# EasyEDA Pro project ProPrj_工训赛物料搬运主控_2025-03-02.epro, board PCB_PCB_主控有光耦2.0_2025-02-19_1
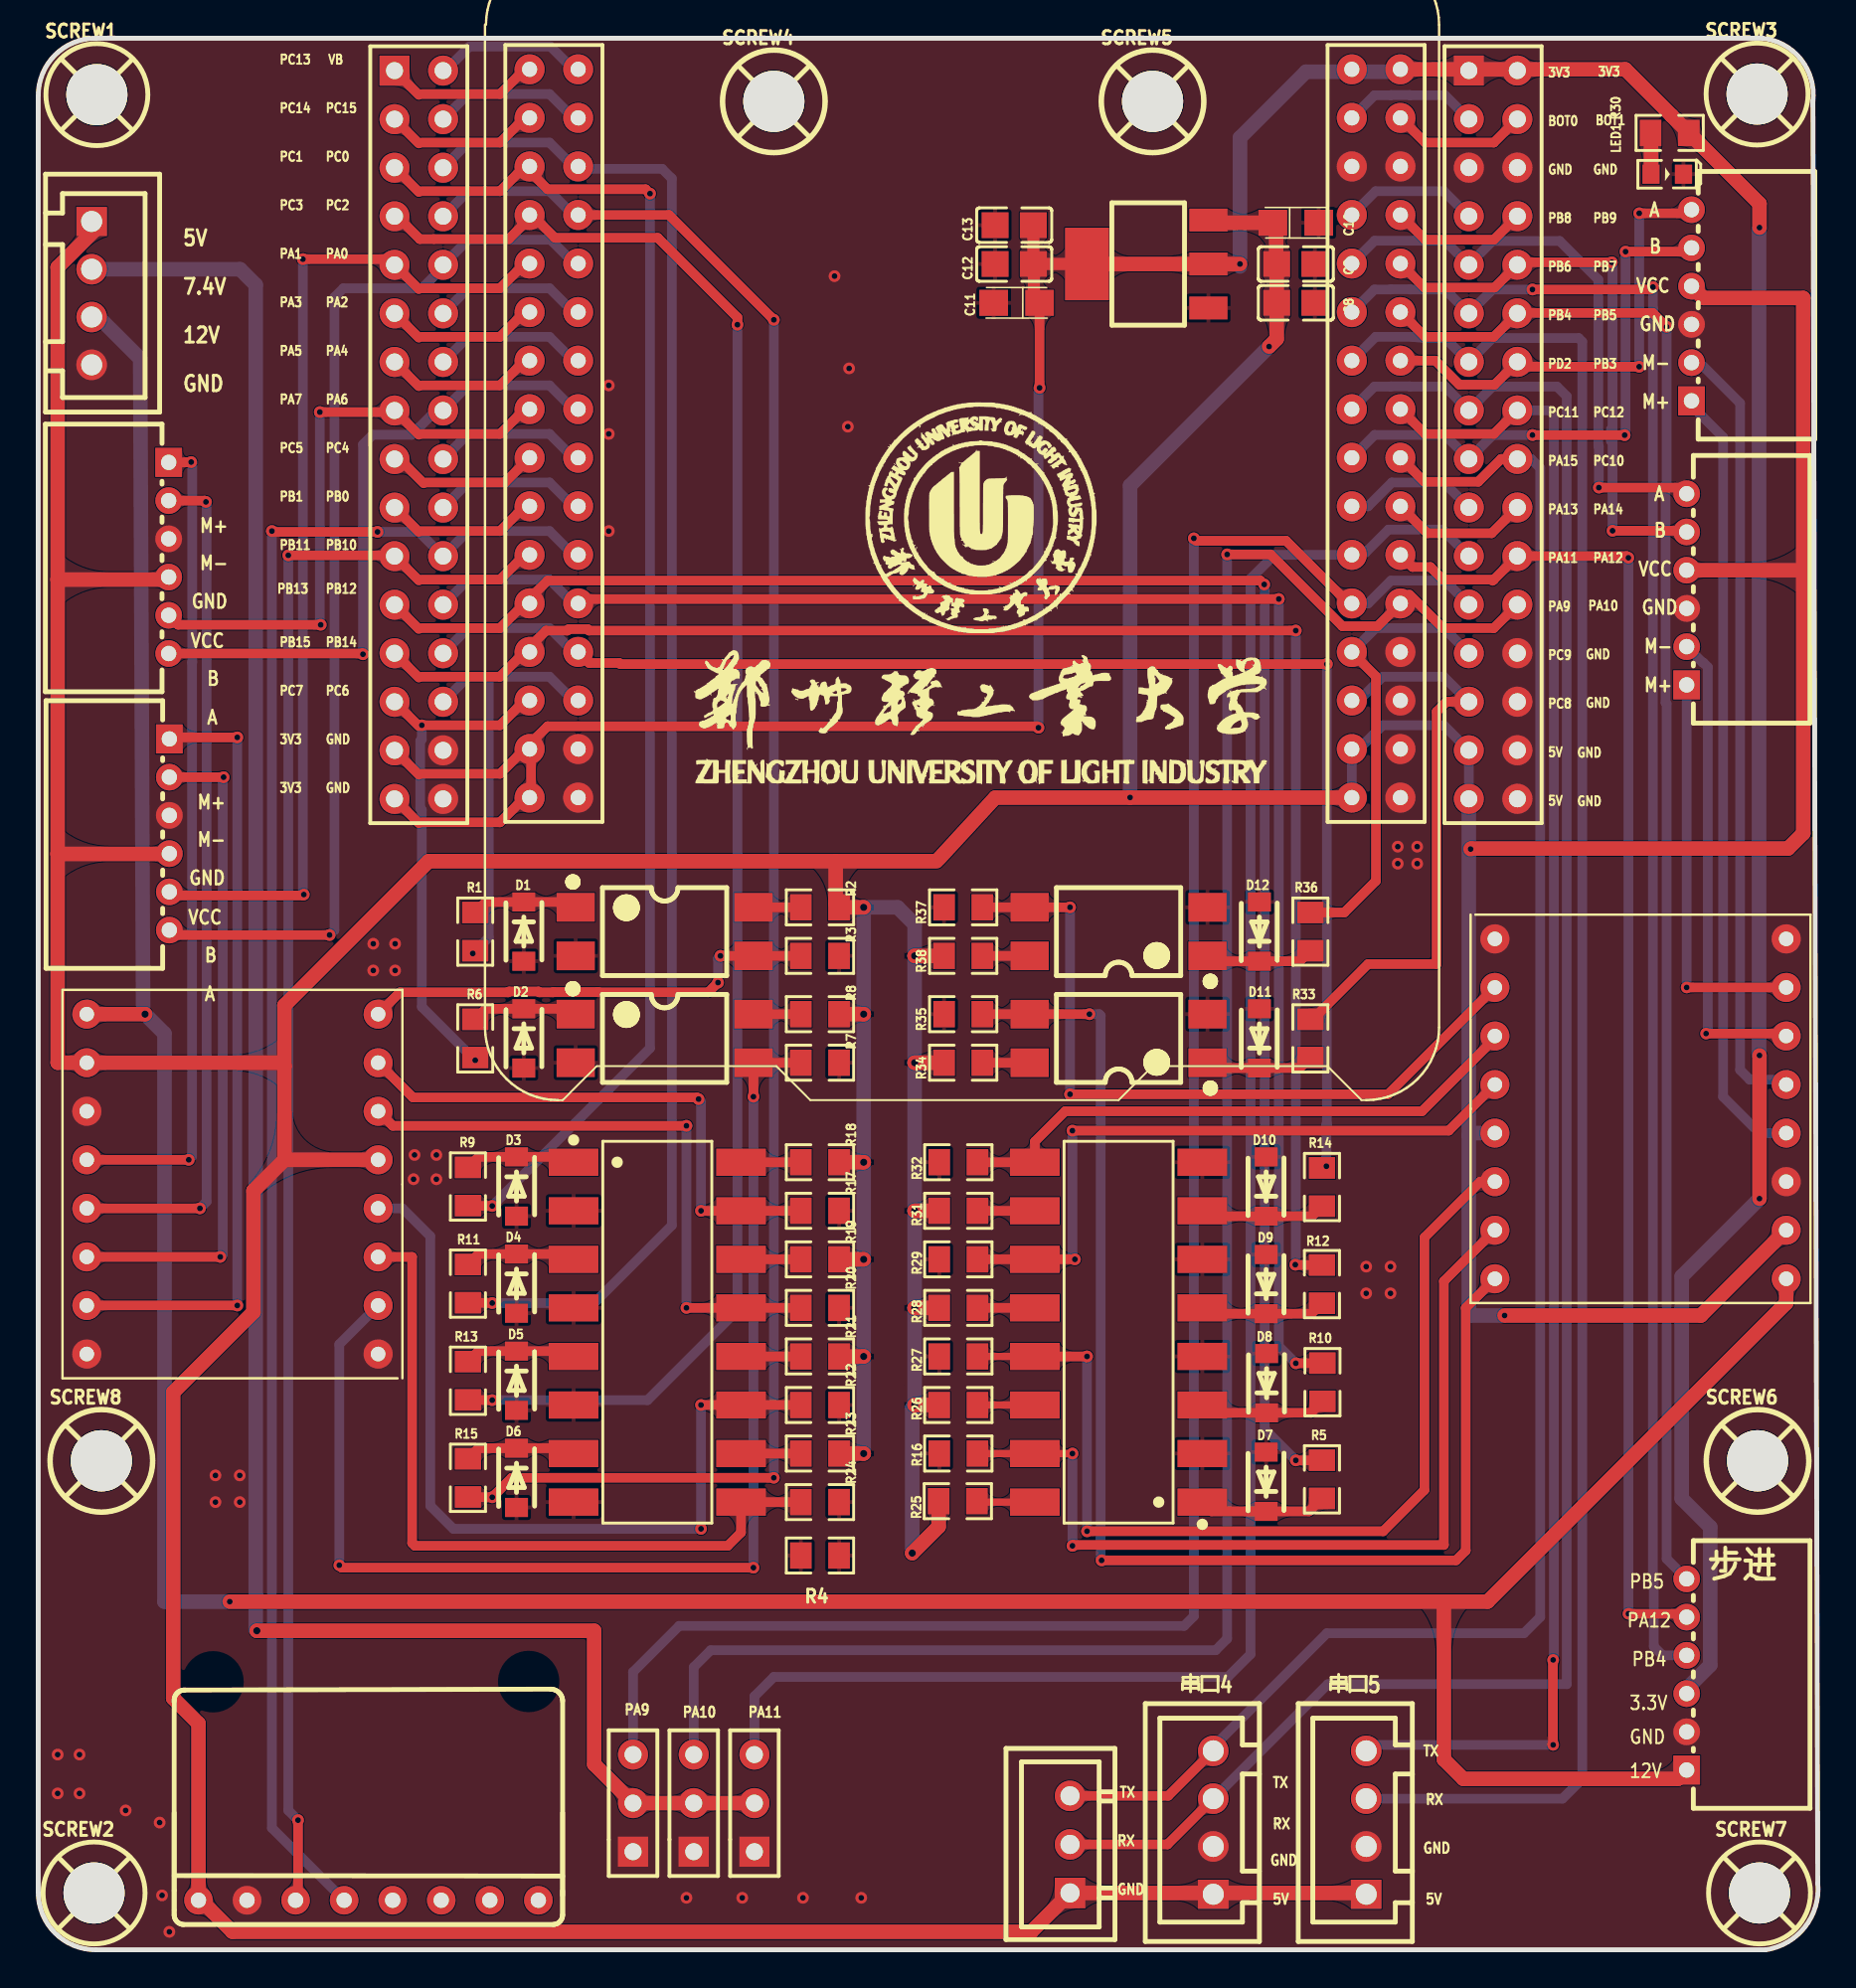
[diagram p5: board, top side]
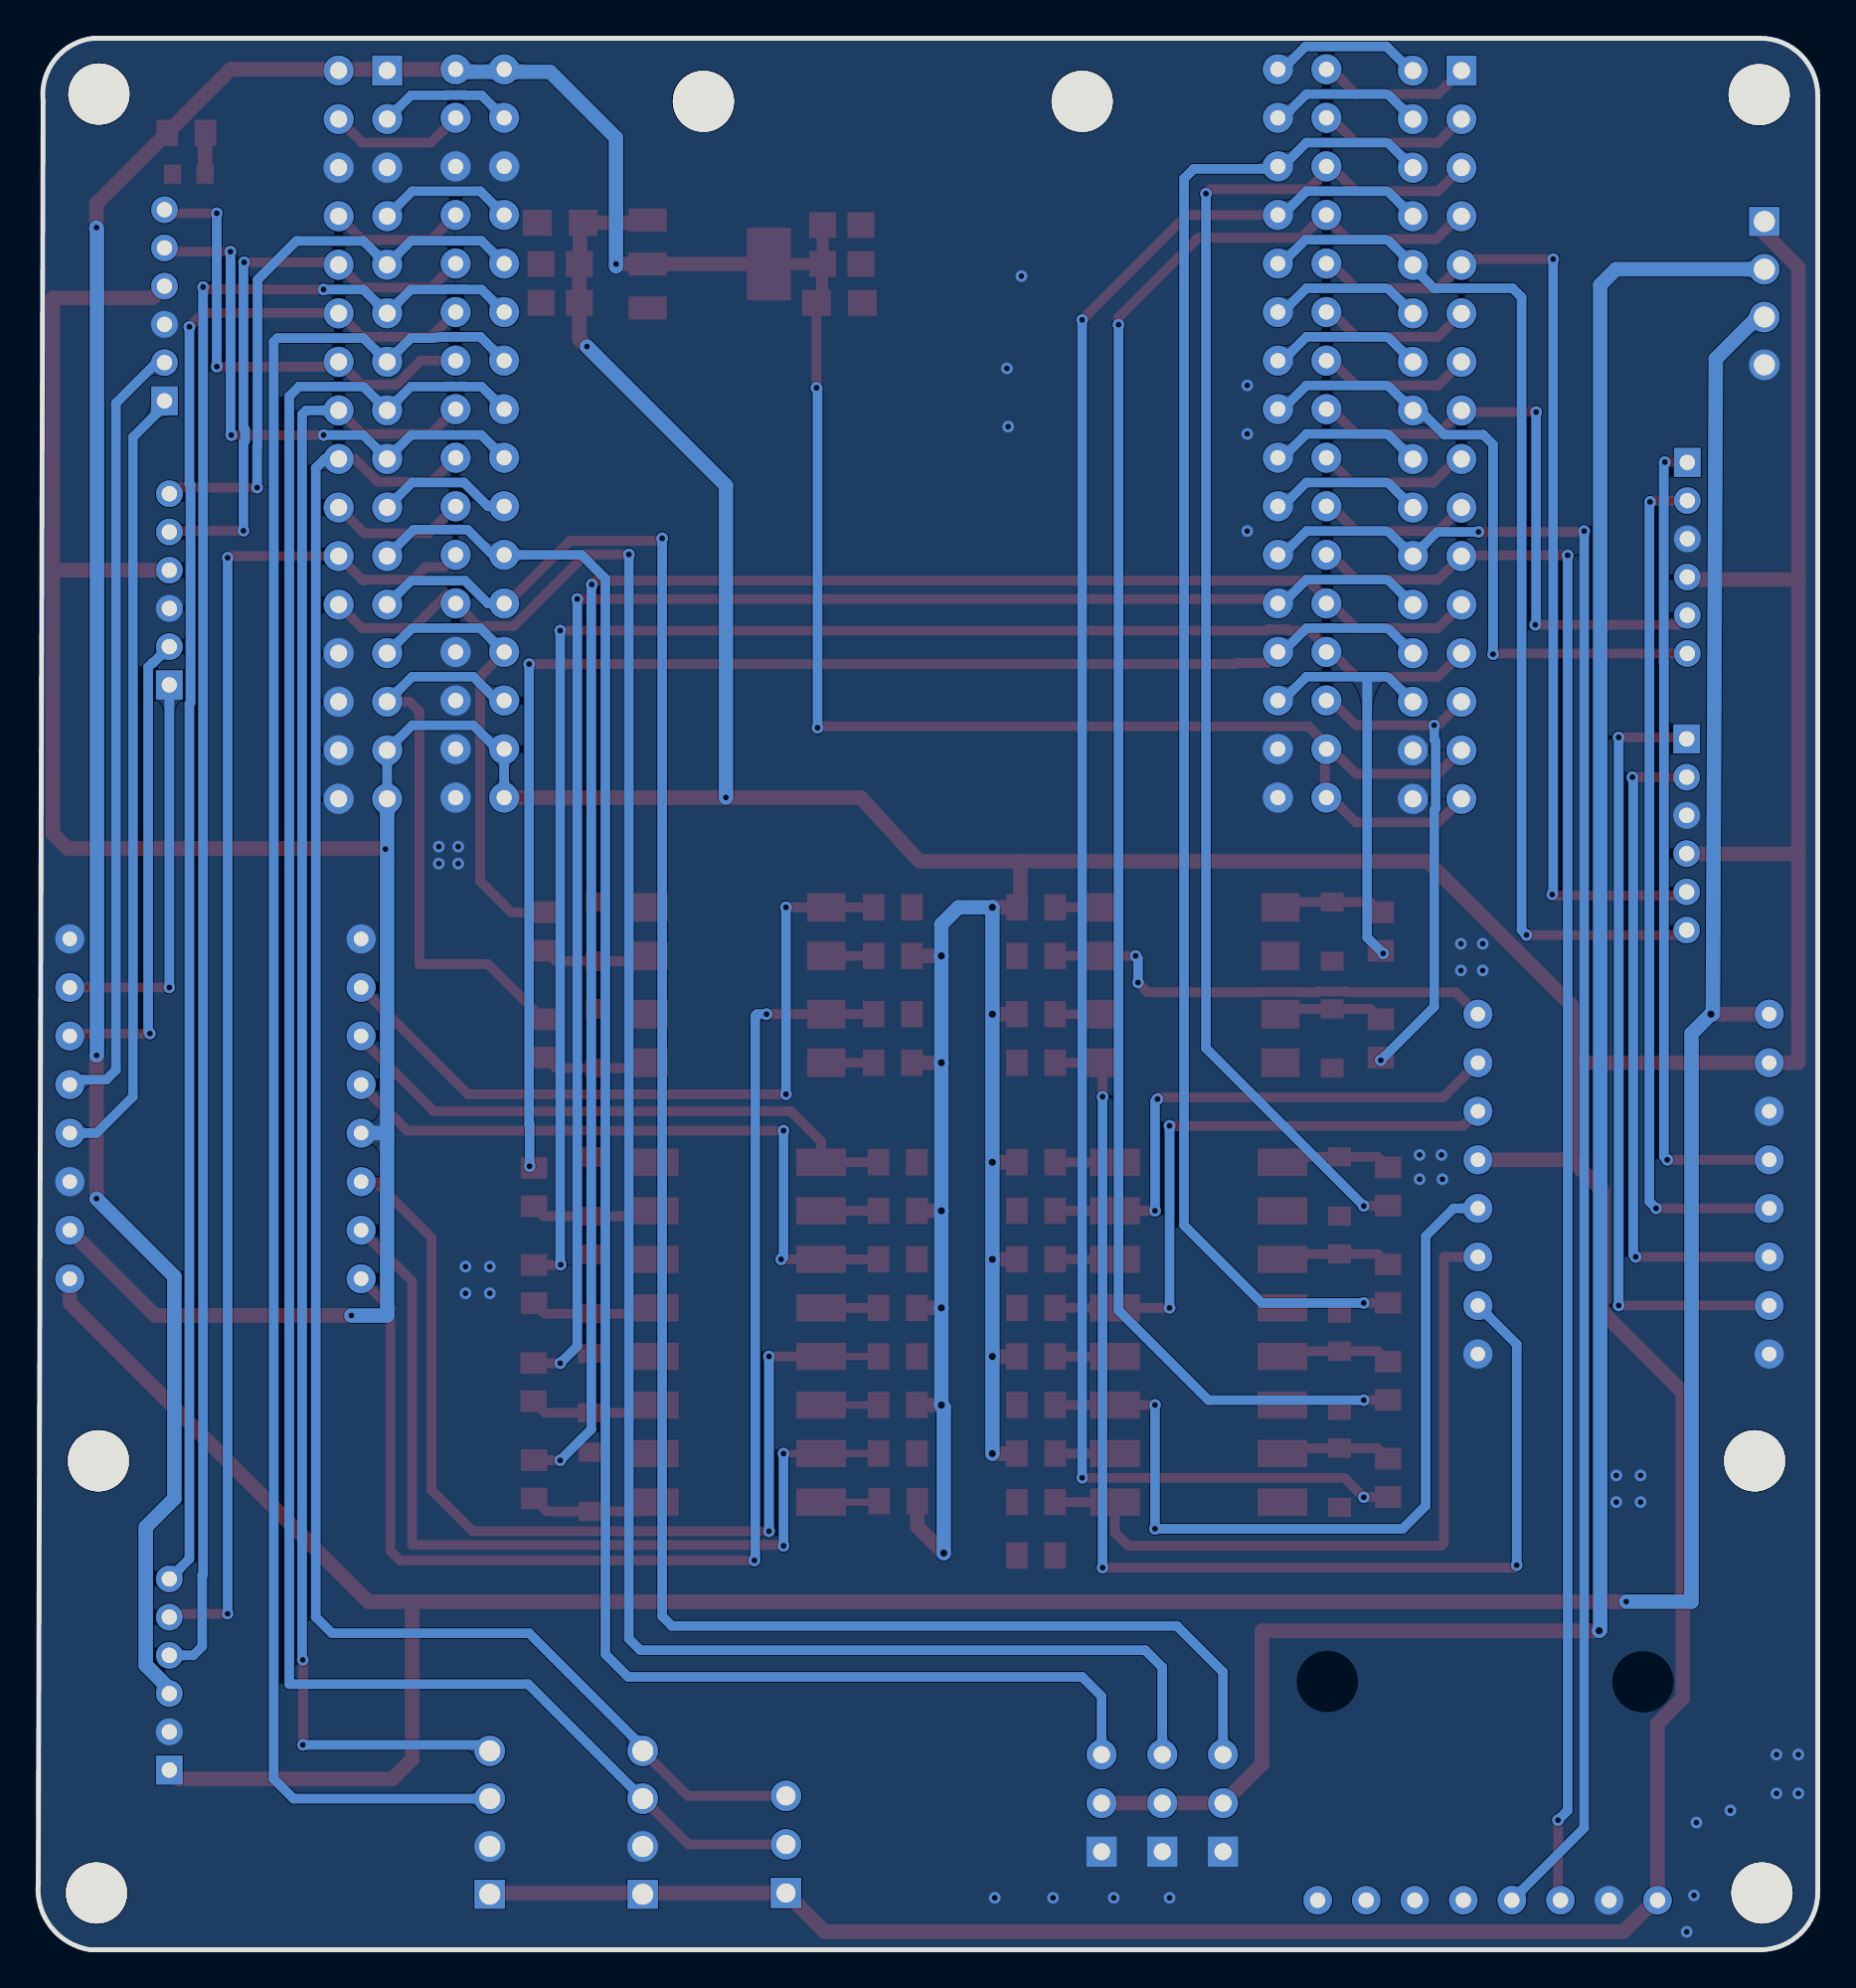
[diagram p6: board, bottom side, seen from below]

Outline 93.09 x 100 mm; copper layers: Top Layer, Bottom Layer. Coordinates in mm from the lower left corner of the outline.
Outline path: 0,97 arc(0.88,99.12) 3,100 90.21,100 arc(92.21,98.9) 92.84,96.7 93.09,3.48 arc(92.43,1.2) 90.38,0 3,0 arc(0.88,0.88) 0,3 0,97
Stack: Top Layer 0.035mm / Dielectric1 1.51mm FR4 er 4.5 / Bottom Layer 0.035mm

## Design rules (mm)
spacing Default (default): track to track 0.152, other pairs 0 to 0.152
track width Default (default): min 0.254, default 0.254, max 25.4
differential pair differentialPair (default): width min 0.127, default 0.254, max 2.54; gap min 0.152, default 0.152
via Default (default): diameter min 0.61, default 0.61, max 100.025; hole min 0.305, default 0.305, max 59.995

## Placement (name value [footprint] x y rotation side)
C8  0.1u  [C0805]  65.79 86.16 180 top
C9  10u  [C0805]  65.79 88.19 180 top
C10  0.1u  [CASE-A_3216]  65.79 90.35 0 top
C11  0.1u  [CASE-A_3216]  51.18 86.16 180 top
C12  10u  [C0805]  51.05 88.19 0 top
C13  0.1u  [C0805]  51.05 90.22 0 top
CN1  KH-PH-6P-W  [CONN-TH_6P-P2.00_KINGHELM_KH-PH-6P-W]  6.82 72.81 270 top
CN2  KH-PH-6P-W  [CONN-TH_6P-P2.00_KINGHELM_KH-PH-6P-W]  6.86 58.34 270 top
CN3  KH-PH-6P-W  [CONN-TH_6P-P2.00_KINGHELM_KH-PH-6P-W]  86.49 86.03 90 top
CN4  KH-PH-6P-W  [CONN-TH_6P-P2.00_KINGHELM_KH-PH-6P-W]  86.23 71.17 90 top
CN7  KH-PH-6P-W  [CONN-TH_6P-P2.00_KINGHELM_KH-PH-6P-W]  86.23 14.4 90 top
CN10  -  [CONN-TH_4P-P2.50_4PIN]  69.47 6.66 90 top
CN10#2  -  [CONN-TH_4P-P2.50_4PIN]  2.79 86.67 270 top
CN11  ZX-XH2.54-4PZZ  [CONN-TH_4P-P2.50_4PIN]  61.47 6.66 90 top
CN12  ZX-XH2.54-3PZZ  [CONN-TH_3P-P2.54_2501S-3P]  53.97 5.51 90 top
D1  1N4001W  [SOD-123F_L2.8-W1.8-LS3.7-RD]  25.4 53.26 270 top
D2  1N4001W  [SOD-123F_L2.8-W1.8-LS3.7-RD]  25.4 47.68 270 top
D3  1N4001W  [SOD-123F_L2.8-W1.8-LS3.7-RD]  25.02 39.93 270 top
D4  1N4001W  [SOD-123F_L2.8-W1.8-LS3.7-RD]  25.02 34.85 270 top
D5  1N4001W  [SOD-123F_L2.8-W1.8-LS3.7-RD]  25.02 29.77 270 top
D6  1N4001W  [SOD-123F_L2.8-W1.8-LS3.7-RD]  25.02 24.69 270 top
D7  1N4001W  [SOD-123F_L2.8-W1.8-LS3.7-RD]  64.23 24.48 90 top
D8  1N4001W  [SOD-123F_L2.8-W1.8-LS3.7-RD]  64.26 29.64 90 top
D9  1N4001W  [SOD-123F_L2.8-W1.8-LS3.7-RD]  64.23 34.82 90 top
D10  1N4001W  [SOD-123F_L2.8-W1.8-LS3.7-RD]  64.23 39.93 90 top
D11  1N4001W  [SOD-123F_L2.8-W1.8-LS3.7-RD]  63.88 47.68 90 top
D12  1N4001W  [SOD-123F_L2.8-W1.8-LS3.7-RD]  63.88 53.26 90 top
H1  HDR-F-2.54_2x16  [HDR-F-2.54_2X16]  19.91 79.26 270 top
H2  HDR-F-2.54_2x16  [HDR-F-2.54_2X16]  76.11 79.26 270 top
J2  HDR-M-2.54_1x3  [HDR-M-2.54_1X3]  31.12 7.67 90 top
J3  HDR-M-2.54_1x3  [HDR-M-2.54_1X3]  34.29 7.67 90 top
J4  HDR-M-2.54_1x3  [HDR-M-2.54_1X3]  37.47 7.67 90 top
LED1  LED-0603_R  [LED0603_RED]  85.22 92.89 0 top
P1  -  [MPU6050模块]  17.53 5.89 270 top
R1  215Ω  [R0805]  22.86 53.26 90 top
R2  2k  [R0805]  40.89 54.53 0 top
R3  10k  [R0805]  40.89 51.99 0 top
R4  0  [R0805]  40.89 20.62 0 top
R5  215Ω  [R0805]  67.16 24.61 270 top
R6  215Ω  [R0805]  22.86 47.68 90 top
R7  10k  [R0805]  40.89 46.41 0 top
R8  2k  [R0805]  40.89 48.95 0 top
R9  215Ω  [R0805]  22.48 39.93 90 top
R10  215Ω  [R0805]  67.18 29.69 270 top
R11  215Ω  [R0805]  22.48 34.85 90 top
R12  215Ω  [R0805]  67.16 34.82 270 top
R13  215Ω  [R0805]  22.48 29.77 90 top
R14  215Ω  [R0805]  67.16 39.9 270 top
R15  215Ω  [R0805]  22.48 24.69 90 top
R16  10k  [R0805]  48.13 25.96 180 top
R17  10k  [R0805]  40.89 38.66 0 top
R18  2k  [R0805]  40.89 41.2 0 top
R19  2k  [R0805]  40.89 36.12 0 top
R20  10k  [R0805]  40.89 33.58 0 top
R21  2k  [R0805]  40.89 31.04 0 top
R22  10k  [R0805]  40.89 28.5 0 top
R23  2k  [R0805]  40.89 25.96 0 top
R24  10k  [R0805]  40.89 23.42 0 top
R25  2k  [R0805]  48.1 23.47 180 top
R26  2k  [R0805]  48.13 28.5 180 top
R27  10k  [R0805]  48.13 31.04 180 top
R28  2k  [R0805]  48.13 33.58 180 top
R29  10k  [R0805]  48.13 36.12 180 top
R30  1k  [R0805]  85.34 95.05 0 top
R31  2k  [R0805]  48.13 38.66 180 top
R32  10k  [R0805]  48.13 41.2 180 top
R33  215Ω  [R0805]  66.55 47.68 270 top
R34  2k  [R0805]  48.39 46.41 180 top
R35  10k  [R0805]  48.39 48.95 180 top
R36  215Ω  [R0805]  66.55 53.26 270 top
R37  10k  [R0805]  48.39 54.53 180 top
R38  2k  [R0805]  48.39 51.99 180 top
SCREW1  -  [M3螺丝]  3.07 97.05 0 top
SCREW2  -  [M3螺丝]  2.92 2.97 0 top
SCREW3  -  [M3螺丝]  89.92 97.08 0 top
SCREW4  -  [M3螺丝]  38.48 96.7 0 top
SCREW5  -  [M3螺丝]  58.29 96.7 0 top
SCREW6  -  [M3螺丝]  89.94 25.58 0 top
SCREW7  -  [M3螺丝]  90.04 2.97 0 top
SCREW8  -  [M3螺丝]  3.3 25.58 0 top
U1  NO  [STM32F103RCT6最小系统]  48.77 79.43 0 top
U2  -  [TB6612电机驱动]  10.16 40.06 0 top
U3  -  [TB6612电机驱动]  83.82 43.99 180 top
U4  AMS1117-3.3  [SOT-223]  58.04 88.19 180 top
U5  TLP521-1XSM  [SMD-4_L4.6-W6.5-P2.54-LS10.2-BL]  32.77 47.68 270 top
U7  TLP521-1XSM  [SMD-4_L4.6-W6.5-P2.54-LS10.2-BL]  32.77 53.26 270 top
U8  TLP521-4XSM  [SMD-16_L20.0-W6.5-P2.54-LS10.2-BL]  32.38 32.31 270 top
U9  TLP521-4XSM  [SMD-16_L20.0-W6.5-P2.54-LS10.2-BL]  56.51 32.31 90 top
U10  TLP521-1XSM  [SMD-4_L4.6-W6.5-P2.54-LS10.2-BL]  56.51 47.68 90 top
U11  TLP521-1XSM  [SMD-4_L4.6-W6.5-P2.54-LS10.2-BL]  56.51 53.26 90 top

## Footprints (pads in the part's own frame, mm; a bottom-side part is the same pattern mirrored in y, then rotated)
C0805
  rect 1.41x1.35 smd: 1(-1,0) 2(1,0)
CASE-A_3216
  rect 1.5x1.359 smd: 1(-1.2,0) 2(1.2,0)
CONN-TH_3P-P2.54_2501S-3P
  rect 1.6x1.6 hole 1: 1(-2.54,0)
  round 1.6 hole 1: 2(0,0) 3(2.54,0)
CONN-TH_4P-P2.50_4PIN
  rect 1.524x1.6 hole 1.1: 1(-3.75,0)
  round 1.6 hole 1.1: 2(-1.25,0) 3(1.25,0) 4(3.75,0)
CONN-TH_6P-P2.00_KINGHELM_KH-PH-6P-W
  rect 1.524x1.4 hole 0.8: 1(-5,0)
  round 1.4 hole 0.8: 2(-3,0) 3(-1,0) 4(1,0) 5(3,0) 6(5,0)
HDR-F-2.54_2X16
  rect 1.575x1.575 hole 0.889: 1(-19.05,-1.27)
  round 1.575 hole 0.889: 2(-19.05,1.27) 3(-16.51,-1.27) 4(-16.51,1.27) 5(-13.97,-1.27) 6(-13.97,1.27) 7(-11.43,-1.27) 8(-11.43,1.27) 9(-8.89,-1.27) 10(-8.89,1.27) 11(-6.35,-1.27) 12(-6.35,1.27) 13(-3.81,-1.27) 14(-3.81,1.27) 15(-1.27,-1.27) 16(-1.27,1.27) 17(1.27,-1.27) 18(1.27,1.27) 19(3.81,-1.27) 20(3.81,1.27) 21(6.35,-1.27) 22(6.35,1.27) 23(8.89,-1.27) 24(8.89,1.27) 25(11.43,-1.27) 26(11.43,1.27) 27(13.97,-1.27) 28(13.97,1.27) 29(16.51,-1.27) 30(16.51,1.27) 31(19.05,-1.27) 32(19.05,1.27)
HDR-M-2.54_1X3
  rect 1.575x1.575 hole 0.889: 1(-2.54,0)
  round 1.575 hole 0.889: 2(0,0) 3(2.54,0)
LED0603_RED
  rect 0.9x1 smd: 1(-0.85,0) 2(0.85,0)
M3螺丝
  round 3.2 hole 3.2: 1(0,0)
MPU6050模块
  round 1.5 hole 0.8: 1(3.302,-9.144) 2(3.302,-6.604) 3(3.302,-4.064) 4(3.302,-1.524) 5(3.302,1.016) 6(3.302,3.556) 7(3.302,6.096) 8(3.302,8.636)
R0805
  rect 1.133x1.377 smd: 1(-1,0) 2(1,0)
SMD-4_L4.6-W6.5-P2.54-LS10.2-BL
  rect 1.5x2 smd: 1(-1.27,-4.65) 2(1.27,-4.65) 3(1.27,4.65) 4(-1.27,4.65)
SMD-16_L20.0-W6.5-P2.54-LS10.2-BL
  rect 1.423x2.6 smd: 1(-8.89,-4.38) 2(-6.35,-4.38) 3(-3.81,-4.38) 4(-1.27,-4.38) 5(1.27,-4.38) 6(3.81,-4.38) 7(6.35,-4.38) 8(8.89,-4.38) 9(8.89,4.38) 10(6.35,4.38) 11(3.81,4.38) 12(1.27,4.38) 13(-1.27,4.38) 14(-3.81,4.38) 15(-6.35,4.38) 16(-8.89,4.38)
SOD-123F_L2.8-W1.8-LS3.7-RD
  rect 1x1.2 smd: 1(-1.55,0) 2(1.55,0)
SOT-223
  rect 2x1.2 smd: 1(-3.175,2.3) 2(-3.175,0) 3(-3.175,-2.3)
  rect 2.3x3.8 smd: 4(3.175,0)
STM32F103RCT6最小系统
  round 1.575 hole 0.787x0.792: 3V3_1(-23.063,-16.611) 3V3_2(-23.063,-19.151) 3V3_3(19.948,18.948) 3V3_4(22.488,18.948) 5V_1(19.948,-16.613) 5V_2(19.948,-19.152) BOOT0(19.948,16.407) BOOT1(22.488,16.407) GND_1(-20.523,-16.611) GND_2(-20.523,-19.151) GND_3(19.948,13.867) GND_4(22.488,13.867) GND_5(22.488,-11.533) GND_6(22.488,-14.072) GND_7(22.488,-16.613) GND_8(22.488,-19.152) PA0(-20.523,8.789) PA1(-23.063,8.789) PA2(-20.523,6.248) PA3(-23.063,6.248) PA4(-20.523,3.708) PA5(-23.063,3.708) PA6(-20.523,1.169) PA7(-23.063,1.169) PA9(19.948,-8.992) PA10(22.488,-8.992) PA11(19.948,-6.452) PA12(22.488,-6.452) PA13(19.948,-3.913) PA14(22.488,-3.913) PA15(19.948,-1.373) PB0(-20.523,-3.912) PB1(-23.063,-3.912) PB3(22.488,3.708) PB4(19.948,6.247) PB5(22.488,6.247) PB6(19.948,8.787) PB7(22.488,8.787) PB8(19.948,11.328) PB9(22.488,11.328) PB10(-20.523,-6.452) PB11(-23.063,-6.452) PB12(-20.523,-8.992) PB13(-23.063,-8.992) PB14(-20.523,-11.531) PB15(-23.063,-11.531) PC0(-20.523,13.868) PC1(-23.063,13.868) PC2(-20.523,11.329) PC3(-23.063,11.329) PC4(-20.523,-1.371) PC5(-23.063,-1.371) PC6(-20.523,-14.072) PC7(-23.063,-14.072) PC8(19.948,-14.072) PC9(19.948,-11.533) PC10(22.488,-1.373) PC11(19.948,1.167) PC12(22.488,1.167) PC13(-23.063,18.948) PC14(-23.063,16.409) PC15(-20.523,16.409) PD2(19.948,3.708) VB(-20.523,18.948)
TB6612电机驱动
  round 1.524 hole 0.762: 1(7.62,8.89) 2(7.62,6.35) 3(7.62,3.81) 4(7.62,1.27) 5(7.62,-1.27) 6(7.62,-3.81) 7(7.62,-6.35) 8(7.62,-8.89) 9(-7.62,-8.89) 10(-7.62,-6.35) 11(-7.62,-3.81) 12(-7.62,-1.27) 13(-7.62,1.27) 14(-7.62,3.81) 15(-7.62,6.35) 16(-7.62,8.89)

## Nets
3.3V: C11.1 C12.2 C13.2 CN7.3 H1.29 H1.31 H2.1 H2.2 R30.2 U1.3V3_1 U1.3V3_2 U1.3V3_3 U1.3V3_4 U4.2 U4.4
5V: C8.2 C9.2 C10.1 CN1.4 CN2.4 CN3.4 CN4.4 CN10.1 CN10#2.1 CN11.1 CN12.1 H2.29 H2.31 P1.1 R2.2 R8.2 R18.2 R19.2 R21.2 R23.2 R25.2 R26.2 R28.2 R31.2 R34.2 R38.2 U1.5V_1 U1.5V_2 U2.4 U2.15 U3.4 U3.15 U4.3
7.4V: CN10#2.2 J2.2 J3.2 J4.2
12V: CN7.1 CN10#2.3 U2.16 U3.16
GND: C8.1 C9.1 C10.2 C11.2 C12.1 C13.1 CN1.3 CN2.3 CN3.3 CN4.3 CN7.2 CN10.2 CN10#2.4 CN11.2 D1.2 D2.2 D3.2 D4.2 D5.2 D6.2 D7.2 D8.2 D9.2 D10.2 D11.2 D12.2 H1.30 H1.32 H2.5 H2.6 H2.26 H2.28 H2.30 H2.32 J2.1 J3.1 J4.1 LED1.2 P1.2 R4.1 U1.GND_1 U1.GND_2 U1.GND_3 U1.GND_4 U1.GND_5 U1.GND_6 U1.GND_7 U1.GND_8 U2.8 U2.9 U2.14 U3.8 U3.9 U3.14 U4.1 U5.2 U7.2 U8.2 U8.4 U8.6 U8.8 U9.2 U9.4 U9.6 U9.8 U10.2 U11.2
BOOT0: H2.3 U1.BOOT0
BOOT1: H2.4 U1.BOOT1
D1_1: D1.1 R1.2 U7.1
D3_1: D3.1 R9.2 U8.1
D4_1: D4.1 R11.2 U8.3
D5_1: D5.1 R13.2 U8.5
D6_1: D6.1 R15.2 U8.7
GGND: R3.2 R4.2 R7.2 R16.2 R17.2 R20.2 R22.2 R24.2 R27.2 R29.2 R32.2 R35.2 R37.2
LA1: CN1.6 H1.16 U1.PA6
LA2: CN2.6 H1.10 U1.PA0
LAIN1: H1.6 R11.1 U1.PC0
LAIN2: H1.5 R9.1 U1.PC1
LAO1: CN1.1 U2.13
LAO2: CN1.2 U2.12
LB1: CN1.5 H1.15 U1.PA7
LB2: CN2.5 H1.9 U1.PA1
LBIN1: H1.7 R13.1 U1.PC3
LBIN2: H1.8 R15.1 U1.PC2
LBO1: CN2.1 U2.10
LBO2: CN2.2 U2.11
LED17_1: LED1.1 R30.1
LINA1: R20.1 U2.3 U8.13
LINA2: R17.1 U2.2 U8.15
LINB1: R22.1 U2.5 U8.11
LINB2: R24.1 U2.6 U8.9
LPA: R3.1 U2.1 U7.3
LPB: R7.1 U2.7 U5.3
LPWMA: H1.28 R1.1 U1.PC6
LPWMB: H1.27 R6.1 U1.PC7
PA2: H1.12 U1.PA2
PA3: H1.11 U1.PA3
PA4: H1.14 U1.PA4
PA5: H1.13 U1.PA5
PA9: H2.23 J2.3 U1.PA9
PA10: H2.24 J3.3 U1.PA10
PA11: H2.21 J4.3 U1.PA11
PA12: CN7.5 H2.22 U1.PA12
PB0: H1.20 U1.PB0
PB1: H1.19 U1.PB1
PB4: CN7.4 H2.11 U1.PB4
PB5: CN7.6 H2.12 U1.PB5
PB8: H2.7 U1.PB8
PB9: H2.8 U1.PB9
PC4: H1.18 U1.PC4
PC5: H1.17 U1.PC5
PC10: CN11.4 CN12.3 H2.18 U1.PC10
PC11: CN11.3 CN12.2 H2.15 U1.PC11
PC12: CN10.4 H2.16 U1.PC12
PC13: H1.1 U1.PC13
PC14: H1.3 U1.PC14
PC15: H1.4 U1.PC15
PD2: CN10.3 H2.13 U1.PD2
R2_1: R2.1 U7.4
R6_2: D2.1 R6.2 U5.1
R8_1: R8.1 U5.4
R18_1: R18.1 U8.16
R19_1: R19.1 U8.14
R21_1: R21.1 U8.12
R23_1: R23.1 U8.10
RA1: CN3.6 H2.14 U1.PB3
RA2: CN4.6 H2.9 U1.PB6
RAIN1: H1.24 R10.1 U1.PB12
RAIN2: H1.23 R5.1 U1.PB13
RAO1: CN3.1 U3.13
RAO2: CN3.2 U3.12
RB1: CN3.5 H2.17 U1.PA15
RB2: CN4.5 H2.10 U1.PB7
RBIN1: H1.25 R12.1 U1.PB15
RBIN2: H1.26 R14.1 U1.PB14
RBO1: CN4.1 U3.10
RBO2: CN4.2 U3.11
RINA1: R27.1 U3.3 U9.13
RINA2: R16.1 U3.2 U9.15
RINB1: R29.1 U3.5 U9.11
RINB2: R32.1 U3.6 U9.9
RPA: R35.1 U3.1 U10.3
RPB: R37.1 U3.7 U11.3
RPWMA: H2.27 R33.1 U1.PC8
RPWMB: H2.25 R36.1 U1.PC9
SCL: H1.21 P1.3 U1.PB11
SDA: H1.22 P1.4 U1.PB10
SWCLK: H2.20 U1.PA14
SWDIO: H2.19 U1.PA13
U9_1: D7.1 R5.2 U9.1
U9_3: D8.1 R10.2 U9.3
U9_5: D9.1 R12.2 U9.5
U9_7: D10.1 R14.2 U9.7
U9_10: R31.1 U9.10
U9_12: R28.1 U9.12
U9_14: R26.1 U9.14
U9_16: R25.1 U9.16
U10_1: D11.1 R33.2 U10.1
U10_4: R34.1 U10.4
U11_1: D12.1 R36.2 U11.1
U11_4: R38.1 U11.4
VB: H1.2 U1.VB

Pads without a net: P1 5 6 7 8; SCREW1 1; SCREW2 1; SCREW3 1; SCREW4 1; SCREW5 1; SCREW6 1; SCREW7 1; SCREW8 1

## Via types
v1: diameter 0.762, hole 0.381, Top Layer to Bottom Layer, 14 vias
v2: diameter 0.61, hole 0.305, Top Layer to Bottom Layer, 56 vias
v3: diameter 0.62, hole 0.31, Top Layer to Bottom Layer, 70 vias

## Routing (per net, layer and track width the routed paths; a pad name or vN(x,y) marks a point on that pad's centre or on a via; arc(x,y) is an arc through that point)
3.3V: length 202.4
  Top Layer w0.508: 19.91,58.94 H1.31 ; 25.45,62.81 24.16,61.52 20.07,61.52 ; 25.45,62.81 25.78,62.48 25.78,60.6 24.16,58.98 20.07,58.98 ; 25.45,62.81 26.64,64.01 52.25,64.01 v3(52.32,63.93) ; C11.1 v3(52.38,81.71) ; H1.29 19.91,61.48
  Top Layer w0.635: 52.09,88.19 U4.4 ; 52.09,88.19 52.06,88.22 52.06,90.22 ; 52.09,88.19 52.09,86.45 C11.1
  Top Layer w0.762: H2.2 77.44,98.37 ; 77.44,98.37 U1.3V3_4 ; 77.44,98.37 83.03,98.37 85.44,95.96 85.44,95.95 R30.2 90.04,91.35 v2(90.04,90.09) ; v3(62.87,88.19) U4.2 U4.4 ; v2(90.04,46.79) v2(90.04,39.29)
  Bottom Layer w0.508: v3(52.38,81.71) 52.32,81.66 v3(52.32,63.93)
  Bottom Layer w0.762: v2(90.04,90.09) 90.04,90.02 90.02,89.99 90.02,46.81 v2(90.04,46.79) ; 71.64,98.37 71.51,98.25 66.32,98.25 62.87,94.79 62.87,88.06 ; CN7.3 86.23,13.66 87.47,14.89 87.47,22.11 85.97,23.61 85.97,35.22 v2(90.04,39.29)
5V: length 484.9
  Top Layer w0.762: R31.2 v1(45.85,38.66) ; R26.2 v1(45.85,28.5) ; 92.33,72.19 92.31,72.17 CN4.4 ; 92.33,72.19 92.33,86.41 87.11,86.41 CN3.4 ; 92.33,72.19 92.33,58.4 91.54,57.61 74.96,57.61 v2(74.93,57.58) ; 41.71,56.95 41.71,54.71 R2.2 v1(43.18,54.53) ; 41.71,56.95 46.99,56.95 ; 41.71,56.95 20.42,56.95 12.88,49.41 12.88,46.23 ; 1.02,71.68 6.77,71.68 6.82,71.73 ; 1.02,71.68 1.02,57.33 ; 1.02,71.68 1.02,88.02 3.1,90.11 CN10#2.1 ; 8.51,2.59 10.16,0.94 51.94,0.94 CN12.1 61.4,2.97 CN11.1 61.53,2.97 69.54,2.97 CN10.1 ; 1.02,57.33 6.84,57.33 CN2.4 ; 1.02,57.33 1.02,46.41 U2.15 12.7,46.41 12.88,46.23 ; 41.9,36.12 v1(43.18,36.12) ; v2(76.71,33.18) 86.98,33.18 U3.15 ; 12.88,41.33 11.26,39.7 11.26,33.36 7.06,29.16 7.06,13.16 8.38,11.84 P1.1 ; 12.88,41.33 12.88,46.23 ; 12.88,41.33 U2.4 ; C8.2 64.79,84.27 v2(64.39,83.87) ; 57.11,60.27 v2(57.12,60.28) ; 57.11,60.27 50.06,60.27 47.12,57.07 ; 57.11,60.27 U1.5V_2 ; 64.78,86.16 64.78,88.16 64.75,88.19 64.75,90.18 ; 41.9,48.95 v1(43.18,48.95) ; 41.9,41.2 v1(43.18,41.2) ; 41.9,31.04 v1(43.18,31.04) ; U4.3 61.36,90.35 C10.1 ; v1(45.72,20.75) 47.1,22.14 47.1,23.47 ; R28.2 v1(45.85,33.58) ; 47.39,51.99 v1(45.85,51.99) ; 47.39,46.41 v1(45.85,46.41) ; 41.9,25.96 v1(43.18,25.96) ; 53.72,3.35 54.04,3.04
  Bottom Layer w0.508: H2.31 H2.29 73.53,64.06 70.33,64.06 69.09,62.81 ; U1.5V_2 U1.5V_1
  Bottom Layer w0.762: v2(76.71,33.18) 74.84,33.18 74.84,42.6 ; H2.31 74.84,42.6 ; 74.84,42.6 74.96,42.72 U3.4 ; v1(43.18,25.96) v1(43.18,31.04) v1(43.18,36.12) v1(43.18,41.2) v1(43.18,48.95) v1(43.18,54.53) 44.96,54.53 45.85,53.64 v1(45.85,51.99) v1(45.85,46.41) v1(45.85,38.66) v1(45.85,33.58) v1(45.85,28.5) 45.72,28.37 v1(45.72,20.75) ; v2(57.12,60.28) 57.12,76.6 v2(64.39,83.87)
7.4V: length 113.2
  Top Layer w0.762: v1(11.44,16.69) 29.08,16.69 29.08,9.7 J2.2 J3.2 J4.2
  Bottom Layer w0.762: v1(11.44,16.69) 11.38,16.74 11.38,87.1 10.56,87.92 CN10#2.2
12V: length 186.1
  Top Layer w0.762: U2.16 v1(5.59,48.95) ; 73.53,18.21 73.53,9.96 74.55,8.94 85.77,8.94 CN7.1 ; 73.53,18.21 75.82,18.21 91.44,33.83 U3.16 ; 73.53,18.21 v2(10.02,18.21)
  Bottom Layer w0.762: v1(5.59,48.95) 6.6,47.93 6.6,18.21 v2(10.02,18.21) ; CN10#2.3 3.16,85.42 5.33,83.24 5.49,48.95
GND:
  vias: v2(1.02,10.21) v2(1.02,8.18) v2(2.16,10.21) v2(2.16,8.18) v2(4.57,7.29) v2(6.35,6.66) v2(6.48,2.84) v2(6.86,0.94) v2(9.27,24.82) v2(9.27,23.42) v2(10.54,24.82) v2(10.54,23.42) v2(17.53,52.63) v2(17.53,51.23) v2(18.67,52.63) v2(18.67,51.23) v2(19.63,40.31) v2(19.69,41.58) v2(20.83,41.58) v2(20.83,40.31) v2(29.84,81.84) v2(29.84,79.3) v2(29.84,74.22) v2(33.91,2.72) v2(36.83,2.72) v2(40,2.72) v2(41.66,87.55) v2(42.42,82.73) v2(42.35,79.68) v2(43.05,2.72) v2(69.47,35.74) v2(69.47,34.34) v2(70.74,35.74) v2(70.74,34.34) v2(71.12,57.71) v2(71.12,56.82) v2(72.14,57.71) v2(72.14,56.82)
BOOT0: length 7.1
  Bottom Layer w0.508: H2.3 73.59,97.02 71.76,97.02 71.75,97.03 70.76,97.03 70.75,97.02 69.9,97.02 U1.BOOT0
BOOT1: length 7.2
  Top Layer w0.508: U1.BOOT1 72.55,94.54 76.15,94.54 H2.4
D1_1: length 5.6
  Top Layer w0.508: U7.1 27.84,54.81 D1.1 23.41,54.81 R1.2
D3_1: length 5.9
  Top Layer w0.508: 22.48,40.93 23.03,41.48 27.72,41.48 28.01,41.2
D4_1: length 5.9
  Top Layer w0.508: 22.48,35.85 23.03,36.4 27.72,36.4 28.01,36.12
D5_1: length 5.9
  Top Layer w0.508: 22.48,30.77 23.03,31.32 27.72,31.32 28.01,31.04
D6_1: length 5.9
  Top Layer w0.508: 28.01,25.96 27.72,26.24 23.03,26.24 22.48,25.69
LA1: length 33.8
  Top Layer w0.508: v3(16.99,67.78) 16.95,67.81 CN1.6
  Bottom Layer w0.508: 22.61,81.84 26.75,81.84 27.99,80.59 ; v3(16.99,67.78) 16.99,78.75 17.5,79.26 19.54,79.26 20.81,80.53 H1.16 22.45,81.8
LA2: length 56.1
  Top Layer w0.508: v3(15.24,53.09) 7.12,53.09 CN2.6
  Bottom Layer w0.508: 22.45,89.42 H1.10 21.18,88.02 20.08,86.92 15.96,86.92 15.49,86.45 15.49,53.34 v3(15.24,53.09) ; 22.61,89.46 26.8,89.46 27.99,88.27 27.99,88.21
LAIN1: length 80
  Top Layer w0.508: v3(23.75,33.83) R11.1
  Bottom Layer w0.508: v3(23.75,33.83) 29.08,33.83 33.15,37.9 33.15,92.66 32.64,93.17 28.37,93.17 U1.PC0 ; H1.6 22.45,94.5 ; 22.61,94.54 26.75,94.54 27.99,93.29
LAIN2: length 72.5
  Top Layer w0.508: H1.5 19.91,91.96 ; v3(23.75,38.91) R9.1 ; 20.07,92 24.16,92 25.45,93.29 26.64,92.1 31.78,92.1 v3(32,91.87)
  Bottom Layer w0.508: v3(23.75,38.91) 32,47.17 v3(32,91.87)
LAO1: length 43.1
  Top Layer w0.508: U2.13 v3(7.87,41.33) ; CN1.1 7.71,77.81 7.72,77.83 v3(8,77.83)
  Bottom Layer w0.508: v3(7.87,41.33) 8.05,41.5 8.05,67.34 8.06,67.35 8.06,77.77 v3(8,77.83)
LAO2: length 45
  Top Layer w0.508: U2.12 v3(8.46,38.79) ; CN1.2 8.7,75.81 v3(8.77,75.74)
  Bottom Layer w0.508: v3(8.46,38.79) 8.81,39.14 8.81,75.71 v3(8.77,75.74)
LB1: length 31.2
  Top Layer w0.508: 18.55,80.44 18.72,80.44 ; 18.55,80.44 18.51,80.4 ; 18.55,80.44 H1.15 18.72,80.44 ; 18.55,80.44 v3(14.73,80.44) ; 18.72,80.44 19.91,79.26 ; 20.07,79.3 24.16,79.3 25.45,80.59 ; v3(14.78,69.31) 7.32,69.31 CN1.5
  Bottom Layer w0.508: v3(14.73,80.44) 14.73,69.36 v3(14.78,69.31)
LB2: length 53
  Top Layer w0.508: CN2.5 7.05,55.15 13.85,55.15 v2(13.89,55.2) ; 25.45,88.21 24.16,86.92 20.07,86.92 ; 19.91,86.88 H1.9 18.34,88.44 v3(13.84,88.44)
  Bottom Layer w0.508: v3(13.84,88.44) 13.84,55.25 v2(13.89,55.2)
LBIN1: length 89.2
  Top Layer w0.508: H1.7 18.77,90.69 19.96,89.49 24.61,89.49 25.83,90.71 25.83,90.75 27.03,89.56 32.41,89.56 36.58,85.39 v3(36.58,85.01) ; v3(23.75,28.75) R13.1
  Bottom Layer w0.508: v3(36.58,85.01) 36.58,33.45 31.88,28.75 v3(23.75,28.75)
LBIN2: length 97.5
  Top Layer w0.508: v2(38.48,24.69) 24.77,24.69 v3(23.75,23.67) R15.1 ; 27.99,90.75 32.99,90.75 v3(38.48,85.27)
  Bottom Layer w0.508: 22.45,91.96 H1.8 ; v3(38.48,85.27) v2(38.48,24.69) ; 27.99,90.75 26.75,92 22.61,92
LBO1: length 41.2
  Top Layer w0.508: U2.10 v3(10.41,33.71) ; v3(10.41,63.42) 6.94,63.42 CN2.1
  Bottom Layer w0.508: v3(10.41,63.42) v3(10.41,33.71)
LBO2: length 35
  Top Layer w0.508: U2.11 v3(9.53,36.25) ; CN2.2 6.86,61.34 v3(9.7,61.34)
  Bottom Layer w0.508: v3(9.7,61.34) 9.65,61.3 9.65,36.37 v3(9.53,36.25)
LED17_1: length 2.2
  Top Layer w0.762: LED1.1 84.37,95.02 R30.1
LINA1: length 32
  Top Layer w0.508: U2.3 18.54,43.1 v3(33.91,43.1) ; 39.89,33.58 U8.13 v3(33.91,33.58)
  Bottom Layer w0.508: v3(33.91,33.58) v3(33.91,43.1)
LINA2: length 28.7
  Top Layer w0.508: v3(34.54,44.5) 34.46,44.59 19.6,44.59 U2.2 ; 39.89,38.66 v3(34.67,38.66)
  Bottom Layer w0.508: v3(34.67,38.66) 34.67,44.37 v3(34.54,44.5)
LINB1: length 43.8
  Top Layer w0.508: 39.89,28.5 U8.11 v3(34.67,28.5)
  Bottom Layer w0.508: v3(34.67,28.5) v3(34.67,22.02) 21.72,22.02 20.51,23.23 20.51,37.33 19.05,38.79 U2.5
LINB2: length 39.4
  Top Layer w0.508: 17.53,36.5 U2.6 19.56,36.25 19.56,21.28 19.7,21.13 36.07,21.13 36.76,21.83 36.76,23.42 39.89,23.42
LPA: length 24.2
  Top Layer w0.508: v3(35.69,51.99) U7.3 39.89,51.99 ; v3(35.56,50.6) 35.05,50.09 29.3,50.09 29.28,50.1 26.95,50.1 26.93,50.09 26.21,50.09 26.17,50.13 24.63,50.13 24.59,50.09 18.92,50.09 U2.1
  Bottom Layer w0.508: v3(35.69,51.99) 35.56,51.87 v3(35.56,50.6)
LPB: length 65
  Top Layer w0.508: v3(37.41,19.99) 15.88,19.99 v2(15.75,20.12) ; v3(37.41,44.63) 37.42,44.63 U5.3 39.89,46.41
  Bottom Layer w0.508: v2(15.75,20.12) 15.75,31.67 U2.7 ; v3(37.41,19.99) v3(37.41,44.63)
LPWMA: length 22.7
  Top Layer w0.508: R1.1 22.73,52.14 v3(22.73,52.12)
  Bottom Layer w0.508: 23.57,66.6 23.57,52.96 v3(22.73,52.12) ; 23.57,66.6 22.61,66.6 ; 23.57,66.6 26.75,66.6 27.99,65.35 ; 22.45,66.56 H1.28
LPWMB: length 26.6
  Top Layer w0.508: H1.27 19.91,64.02 ; v3(22.86,46.53) R6.1 ; v2(20.07,64.06) 24.16,64.06 25.45,65.35
  Bottom Layer w0.508: v2(20.07,64.06) 20.07,63.32 19.98,63.24 19.98,59.71 20.07,59.63 20.07,49.33 v3(22.86,46.53)
PA2: length 7.7
  Bottom Layer w0.508: 22.61,86.92 26.75,86.92 27.99,85.67 ; 22.45,86.88 H1.12
PA3: length 7.7
  Top Layer w0.508: 20.07,84.38 24.16,84.38 25.45,85.67 ; H1.11 19.91,84.34
PA4: length 7.7
  Bottom Layer w0.508: 22.45,84.34 H1.14 ; 22.61,84.38 26.75,84.38 27.99,83.13
PA5: length 7.7
  Top Layer w0.508: H1.13 19.91,81.8 ; 25.45,83.13 24.16,81.84 20.07,81.84
PA9: length 107.9
  Top Layer w0.508: v3(60.45,73.84) 60.58,73.71 65.28,73.71 68.56,70.43
  Bottom Layer w0.508: v3(60.45,73.84) 60.45,17.45 59.94,16.94 33.53,16.94 31.12,14.53 31.12,10.21 ; U1.PA9 69.57,70.43 70.76,71.63 73.58,71.63 H2.23
PA10: length 107.8
  Top Layer w0.508: U1.PA10 70.06,69.24 68.22,69.24 64.47,72.99 v3(62.19,72.99) ; H2.24 76.15,69.14 73.49,69.14 71.72,70.9
  Bottom Layer w0.508: 34.29,10.21 34.29,14.78 35.18,15.67 61.59,15.67 62.19,16.27 v3(62.19,72.99)
PA11: length 99.2
  Bottom Layer w0.508: H2.21 73.45,74.29 70.63,74.29 69.44,73.1 68.84,73.1 U1.PA11 64.67,72.97 63.42,71.72 63.42,15.46 62.23,14.28 38.48,14.28 37.47,13.26 37.47,10.21
PA12: length 71.5
  Top Layer w0.508: v2(83.19,72.82) 83.1,72.91 H2.22 76.15,71.68 ; 76.15,71.68 73.49,71.68 72.82,72.34 71.89,72.34 U1.PA12 ; 76.15,71.68 76.08,71.61 ; CN7.5 86.06,17.58 v2(83.19,17.58)
  Bottom Layer w0.508: v2(83.19,17.58) v2(83.19,72.82)
PB0: length 7.7
  Bottom Layer w0.508: 22.45,76.72 H1.20 ; 22.61,76.76 26.75,76.76 27.99,75.51
PB1: length 7.7
  Top Layer w0.508: 20.07,74.22 24.16,74.22 25.45,75.51 ; H1.19 19.91,74.18
PB4: length 90.4
  Top Layer w0.508: v3(78.16,86.86) 84.34,86.86 v3(84.47,86.98)
  Bottom Layer w0.508: U1.PB4 69.9,86.86 70.75,86.86 70.76,86.87 71.75,86.87 71.76,86.86 73.59,86.86 H2.11 76.08,86.86 v3(78.16,86.86) ; CN7.4 84.98,15.4 84.51,15.87 84.51,19.59 84.47,19.64 84.47,85.84 84.47,85.84 v3(84.47,86.98)
PB5: length 81.3
  Top Layer w0.508: U1.PB5 72.55,84.38 76.15,84.38 H2.12 77.4,85.63 84.46,85.63 v3(85.19,84.9)
  Bottom Layer w0.508: CN7.6 85.19,20.45 85.19,65.18 85.13,65.24 85.13,76.63 85.19,76.69 v3(85.19,84.9)
PB8: length 7.2
  Bottom Layer w0.508: U1.PB8 69.96,92 73.53,92 H2.7
PB9: length 7.2
  Top Layer w0.508: H2.8 76.15,89.46 72.55,89.46 U1.PB9
PC4: length 7.7
  Bottom Layer w0.508: 27.99,78.05 26.75,79.3 22.61,79.3 ; 22.45,79.26 H1.18
PC5: length 8
  Top Layer w0.508: H1.17 18.89,77.99 20.16,76.72 ; U1.PC5 24.41,76.76 20.32,76.76
PC10: length 97.2
  Top Layer w0.508: CN12.3 59.12,8.05 CN11.4 ; U1.PC10 72.51,76.8 75.33,76.8 76.53,77.99 H2.18
  Bottom Layer w0.508: CN11.4 61.47,10.61 67.41,16.56 77.72,16.56 78.57,17.41 78.57,77.52 78.1,77.99 H2.18
PC11: length 109.8
  Top Layer w0.508: CN12.2 59.07,5.51 CN11.3
  Bottom Layer w0.508: CN11.3 67.46,13.89 79.96,13.89 79.96,81.27 79.45,81.78 76.08,81.78 H2.15 73.59,81.78 71.76,81.78 71.75,81.79 70.76,81.79 70.75,81.78 69.9,81.78 U1.PC11
PC12: length 88.7
  Top Layer w0.508: U1.PC12 72.55,79.3 76.15,79.3 H2.16 ; v2(79.25,15.16) 79.24,15.15 79.24,10.73 v2(79.25,10.72)
  Bottom Layer w0.508: v2(79.25,10.72) 69.78,10.72 CN10.4 ; H2.16 79.07,80.53 79.29,80.31 79.29,15.2 v2(79.25,15.16)
PC13: length 7.7
  Top Layer w0.508: 25.45,98.37 24.16,97.08 20.07,97.08 ; H1.1 19.91,97.04
PC14: length 7.7
  Top Layer w0.508: 20.07,94.54 24.16,94.54 25.45,95.83 ; H1.3 19.91,94.5
PC15: length 7.7
  Bottom Layer w0.508: 27.99,95.83 26.75,97.08 22.61,97.08 ; 22.45,97.04 H1.4
PD2: length 100.6
  Bottom Layer w0.508: U1.PD2 69.96,84.38 71.88,84.38 72.5,84.31 73.59,84.31 H2.13 76.08,84.31 80.58,84.31 80.77,84.12 80.77,8.94 79.74,7.91 CN10.3
R2_1: length 2.5
  Top Layer w0.508: U7.4 39.89,54.53
R6_2: length 5.6
  Top Layer w0.508: U5.1 27.84,49.23 D2.1 23.41,49.23 R6.2
R8_1: length 2.5
  Top Layer w0.508: U5.4 39.89,48.95
R18_1: length 3.1
  Top Layer w0.508: U8.16 39.89,41.2
R19_1: length 3.1
  Top Layer w0.508: U8.14 39.89,36.12
R21_1: length 3.1
  Top Layer w0.508: U8.12 39.89,31.04
R23_1: length 3.1
  Top Layer w0.508: U8.10 39.89,25.96
RA1: length 24.2
  Top Layer w0.508: v3(83.75,90.84) 86.05,90.84 86.23,91.03 ; v3(83.75,82.82) 77.63,82.82 H2.14 76.18,81.88 74.34,81.88 73.09,83.13 U1.PB3
  Bottom Layer w0.508: v3(83.75,82.82) 83.75,82.82 v3(83.75,90.84)
RA2: length 30.9
  Top Layer w0.508: v3(81.64,76.49) 85.91,76.49 CN4.6
  Bottom Layer w0.508: U1.PB6 69.91,89.41 73.58,89.41 H2.9 76.08,89.39 79.59,89.39 81.61,87.37 81.61,78.66 81.64,78.64 v3(81.64,76.49)
RAIN1: length 86.2
  Top Layer w0.508: v3(64.9,70.66) 28.47,70.66 U1.PB12 ; v3(65.79,30.68) R10.1 ; 27.99,70.43 28.02,70.41
  Bottom Layer w0.508: 22.45,71.64 H1.24 ; 22.61,71.68 26.75,71.68 27.99,70.43 ; v3(64.9,70.66) 64.9,31.57 v3(65.79,30.68)
RAIN2: length 94.9
  Top Layer w0.508: v3(65.79,25.6) R5.1 ; H1.23 19.91,69.1 ; v3(64.13,71.42) 63.93,71.63 26.64,71.63 25.45,70.43 24.16,69.14 20.07,69.14
  Bottom Layer w0.508: v3(64.13,71.42) 64.16,71.4 64.16,27.23 v3(65.79,25.6)
RAO1: length 41.3
  Bottom Layer w0.508: 86.23,81.03 88.14,79.12 88.14,44.63 90.04,42.72 U3.13
RAO2: length 41.4
  Bottom Layer w0.508: 86.23,83.03 86.49,83.28 86.65,83.28 89.03,80.91 89.03,46.03 89.53,45.52 91.1,45.52 91.36,45.26
RB1: length 28.7
  Top Layer w0.508: v3(82.99,79.23) 82.98,79.24 v3(78.16,79.24) ; 86.23,89.03 86.04,88.84 v3(83.04,88.84)
  Bottom Layer w0.508: v3(83.04,88.84) 83.03,88.83 83.03,79.28 v3(82.99,79.23) ; v3(78.16,79.24) 76.09,79.24 H2.17 73.58,79.25 69.91,79.25 U1.PA15
RB2: length 30.2
  Top Layer w0.508: CN4.5 86.17,74.23 v3(82.35,74.23) ; v3(82.32,88.28) 77.5,88.28 H2.10 76.18,86.96 72.51,86.96 U1.PB7
  Bottom Layer w0.508: v3(82.35,74.23) 82.35,78.86 82.27,78.94 82.27,79.53 82.35,79.61 82.35,88.24 v3(82.32,88.28)
RBIN1: length 83.2
  Top Layer w0.508: H1.25 19.91,66.56 ; 20.07,66.6 24.16,66.6 26.57,69.01 27.67,69.01 27.75,69.09 28.74,69.09 28.82,69.01 v3(65.79,69.01) ; R12.1 65.78,35.82 v3(65.76,35.84)
  Bottom Layer w0.508: v3(65.79,69.01) 65.79,35.86 v3(65.76,35.84)
RBIN2: length 73.9
  Top Layer w0.508: U1.PB14 28.82,67.32 30.4,67.32 30.45,67.26 v3(67.41,67.26) ; v3(67.39,40.99) 67.24,40.99 R14.1 ; 27.99,67.89 28.12,67.77
  Bottom Layer w0.508: 22.45,69.1 H1.26 ; 27.99,67.89 26.75,69.14 22.61,69.14 ; v3(67.41,67.26) 67.41,43.21 67.39,43.18 v3(67.39,40.99)
RBO1: length 21
  Top Layer w0.508: v2(86.23,50.34) 91.44,50.34
  Bottom Layer w0.508: CN4.1 v2(86.23,50.34)
RBO2: length 25
  Top Layer w0.508: U3.11 91.31,47.93 v2(87.25,47.93)
  Bottom Layer w0.508: v2(87.25,47.93) 87.34,48.02 87.34,67.1 87.1,67.34 87.06,67.34 CN4.2
RINA1: length 51.5
  Top Layer w0.381: U9.13 49.13,31.04
  Top Layer w0.508: v3(54.86,31.04) U9.13 ; v3(54.86,21.9) 70.36,21.9 72.52,24.05 72.52,37.26 75.44,40.18 U3.3
  Bottom Layer w0.508: v3(54.86,21.9) v3(54.86,31.04)
RINA2: length 46.8
  Top Layer w0.381: v3(54.1,25.96) U9.15 49.13,25.96
  Top Layer w0.508: v3(54.1,21.13) 54.15,21.18 73.53,21.18 73.53,34.98 U3.2
  Bottom Layer w0.508: v3(54.1,25.96) v3(54.1,21.13)
RINB1: length 35
  Top Layer w0.508: v3(54.1,42.85) 73.79,42.85 76.2,45.26 ; 49.13,36.12 U9.11 v3(54.23,36.12)
  Bottom Layer w0.508: v3(54.1,42.85) 54.1,36.25 v3(54.23,36.12)
RINB2: length 30.5
  Top Layer w0.508: 49.13,41.2 U9.9 52.13,42.28 53.72,43.87 72.39,43.87 76.2,47.68 U3.6
RPA: length 68.9
  Top Layer w0.508: U3.1 74.68,33.58 74.68,20.88 74.17,20.37 v3(55.63,20.37) ; R35.1 U10.3 v3(54.99,48.95)
  Bottom Layer w0.508: v3(55.63,20.37) 55.58,20.42 55.58,48.86 55.5,48.95 v3(54.99,48.95)
RPB: length 38.9
  Top Layer w0.508: v3(53.97,44.75) 70.61,44.75 76.2,50.34 ; v3(53.97,54.53) U11.3 R37.1
  Bottom Layer w0.508: v3(53.97,44.75) v3(53.97,54.53)
RPWMA: length 29.7
  Top Layer w0.508: H2.27 73.67,65.29 73.15,64.77 73.15,51.56 69.56,51.56 66.68,48.68 R33.1
  Bottom Layer w0.508: H2.27 73.53,66.6 70.33,66.6 69.09,65.35
RPWMB: length 23.8
  Top Layer w0.508: R36.1 68.32,54.26 69.98,55.92 69.98,66.61 68.72,67.87 U1.PC9
  Bottom Layer w0.508: H2.25 73.53,69.14 69.96,69.14 U1.PC9
SCL: length 83.9
  Top Layer w0.508: 25.45,72.97 24.16,71.68 20.07,71.68 ; 13.59,2.59 v3(13.59,6.78) ; 19.91,71.64 H1.21 18.6,72.95 v3(13.08,72.95)
  Bottom Layer w0.508: v3(13.08,72.95) 13.08,7.29 v3(13.59,6.78)
SDA: length 90.4
  Top Layer w0.508: v3(12.22,74.22) 12.27,74.18 v3(17.75,74.18)
  Bottom Layer w0.508: 22.61,74.22 26.75,74.22 27.99,72.97 ; P1.4 12.22,6.37 v3(12.22,74.22) ; 22.45,74.18 H1.22 19.91,74.18 v3(17.75,74.18)
SWCLK: length 7.3
  Top Layer w0.508: H2.20 76.03,74.1 72.67,74.1 U1.PA14
SWDIO: length 7.2
  Bottom Layer w0.508: H2.19 73.53,76.76 70.81,76.76 69.57,75.51 U1.PA13
U9_1: length 6.7
  Top Layer w0.508: 60.89,23.42 61.38,22.93 D7.1 66.48,22.93 R5.2
U9_3: length 6.7
  Top Layer w0.508: R10.2 66.58,28.09 D8.1 61.3,28.09 U9.3
U9_5: length 6.6
  Top Layer w0.508: U9.5 61.2,33.27 D9.1 66.6,33.27 67.16,33.82
U9_7: length 6.6
  Top Layer w0.508: 67.16,38.9 66.63,38.38 61.18,38.38 60.89,38.66
U9_10: length 3
  Top Layer w0.508: 49.13,38.66 52.14,38.66
U9_12: length 3
  Top Layer w0.508: 49.13,33.58 U9.12
U9_14: length 3
  Top Layer w0.381: 49.13,28.5 U9.14
U9_16: length 3.1
  Top Layer w0.381: 52.14,23.42 49.15,23.42 49.11,23.47
U10_1: length 5.7
  Top Layer w0.508: R33.2 66,46.13 D11.1 61.44,46.13 61.17,46.41
U10_4: length 2.5
  Top Layer w0.508: R34.1 U10.4
U11_1: length 5.7
  Top Layer w0.508: R36.2 66,51.71 D12.1 61.44,51.71 61.17,51.99
U11_4: length 2.5
  Top Layer w0.508: R38.1 U11.4
VB: length 7.7
  Bottom Layer w0.508: 27.99,98.37 26.8,99.57 22.56,99.57 21.34,98.35

## Copper pours and planes (outline as drawn; the poured copper is in the pictures)
GND on Top Layer: -5.59,104.06 -5.21,104.44 98.68,104.44 103.76,99.37 103.76,1.19 99.06,-3.5 1.02,-3.5 -5.97,3.48 -5.97,102.67
GND on Bottom Layer: -11.05,108 -10.92,108.13 97.92,108.13 105.03,101.02 105.03,-0.97 99.44,-6.55 -2.41,-6.55 -12.06,3.1 -12.06,105.46
GGND on Top Layer: 43.81,55.68 43.81,53.14 40.89,53.14 40.89,50.34 43.81,50.34 43.81,47.55 40.89,47.55 40.89,45.01 43.81,45.01 43.81,39.8 40.89,39.8 40.89,37.26 43.81,37.26 43.81,34.72 40.89,34.72 40.89,32.18 43.81,32.18 43.81,29.64 40.89,29.64 40.89,27.1 43.81,27.1 43.81,24.56 40.89,24.56 40.89,19.23 43.18,19.23 43.18,22.02 45.21,22.02 45.21,24.56 48.13,24.56 48.13,27.1 45.21,27.1 45.21,29.64 48.13,29.64 48.13,32.18 45.21,32.18 45.21,34.72 48.13,34.72 48.13,37.26 45.21,37.26 45.21,39.8 48.13,39.8 48.13,42.34 45.21,42.34 45.21,47.55 48.39,47.55 48.39,50.34 45.21,50.34 45.21,53.14 48.39,53.14 48.39,55.68

Small or netless copper shapes (teardrops, artwork), in the pictures only: 369 on Top Layer, 178 on Bottom Layer

## Text on the board
Top Silkscreen Layer: PB13 | PC13 | PC14 | PC1 | PC3 | PA1 | PA3 | PA5 | PA7 | PC5 | PB1 | PB11 | PB15 | PC7 | 3V3 | PC15 | PC0 | PC2 | PA0 | PA2 | PA4 | PA6 | PC4 | PB0 | PB10 | PB12 | PB14 | PC6 | GND | VB | BOT0 | PB8 | PB6 | PB4 | PD2 | PC11 | PA15 | PA13 | PA11 | PA9 | PC9 | PC8 | 5V | PA10 | PB9 | PB7 | PB5 | PB3 | PC12 | PC10 | PA14 | PA12 | BOT1 | RX | TX | 3.3V | 12V | VCC | M+ | M- | B | A | 7.4V | 步进 | 串口4 | 串口5
